# Altium schematic sheet TC33X-2-103E1_TC33X-2-103E.schdoc
size 127 x 99 mm
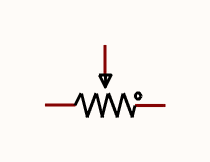
[diagram p0: TC33X-2-103E1_TC33X-2-103E.schdoc]

## Parts
R?  10kΩ  [RES-ADJ-SMD_3P-L3.0-W3.8-P1.75-BR]  (value not drawn)

## Nets

Not connected (* = marked no-connect by the designer): R? 1 2 3

## Library data of the parts
R? = TC33X-2-103E: Manufacturer: BOURNS; Add into BOM: yes; Tolerance: ±25%; Power(Watts): 150mW; Temperature Coefficient: ±250ppm/℃; Turns: 1; Symbol: TC33X-2-103E; Device: TC33X-2-103E; LCSC Part Name: 10kΩ ±25%; Supplier Part: C719176; Manufacturer Part: TC33X-2-103E; Supplier Footprint: SMD-3P,3.8x3.6mm; JLCPCB Part Class: Extended Part; Datasheet: https://atta.szlcsc.com/upload/public/pdf/source/20200810/C720646_BB66A75E654D5E1D30127FF45BCD3C26.pdf; Supplier: LCSC; Convert to PCB: yes; Value: 10kΩ; Rated Voltage: -